# EAGLE schematic diagrama_robot (EAGLE 9.6.2)
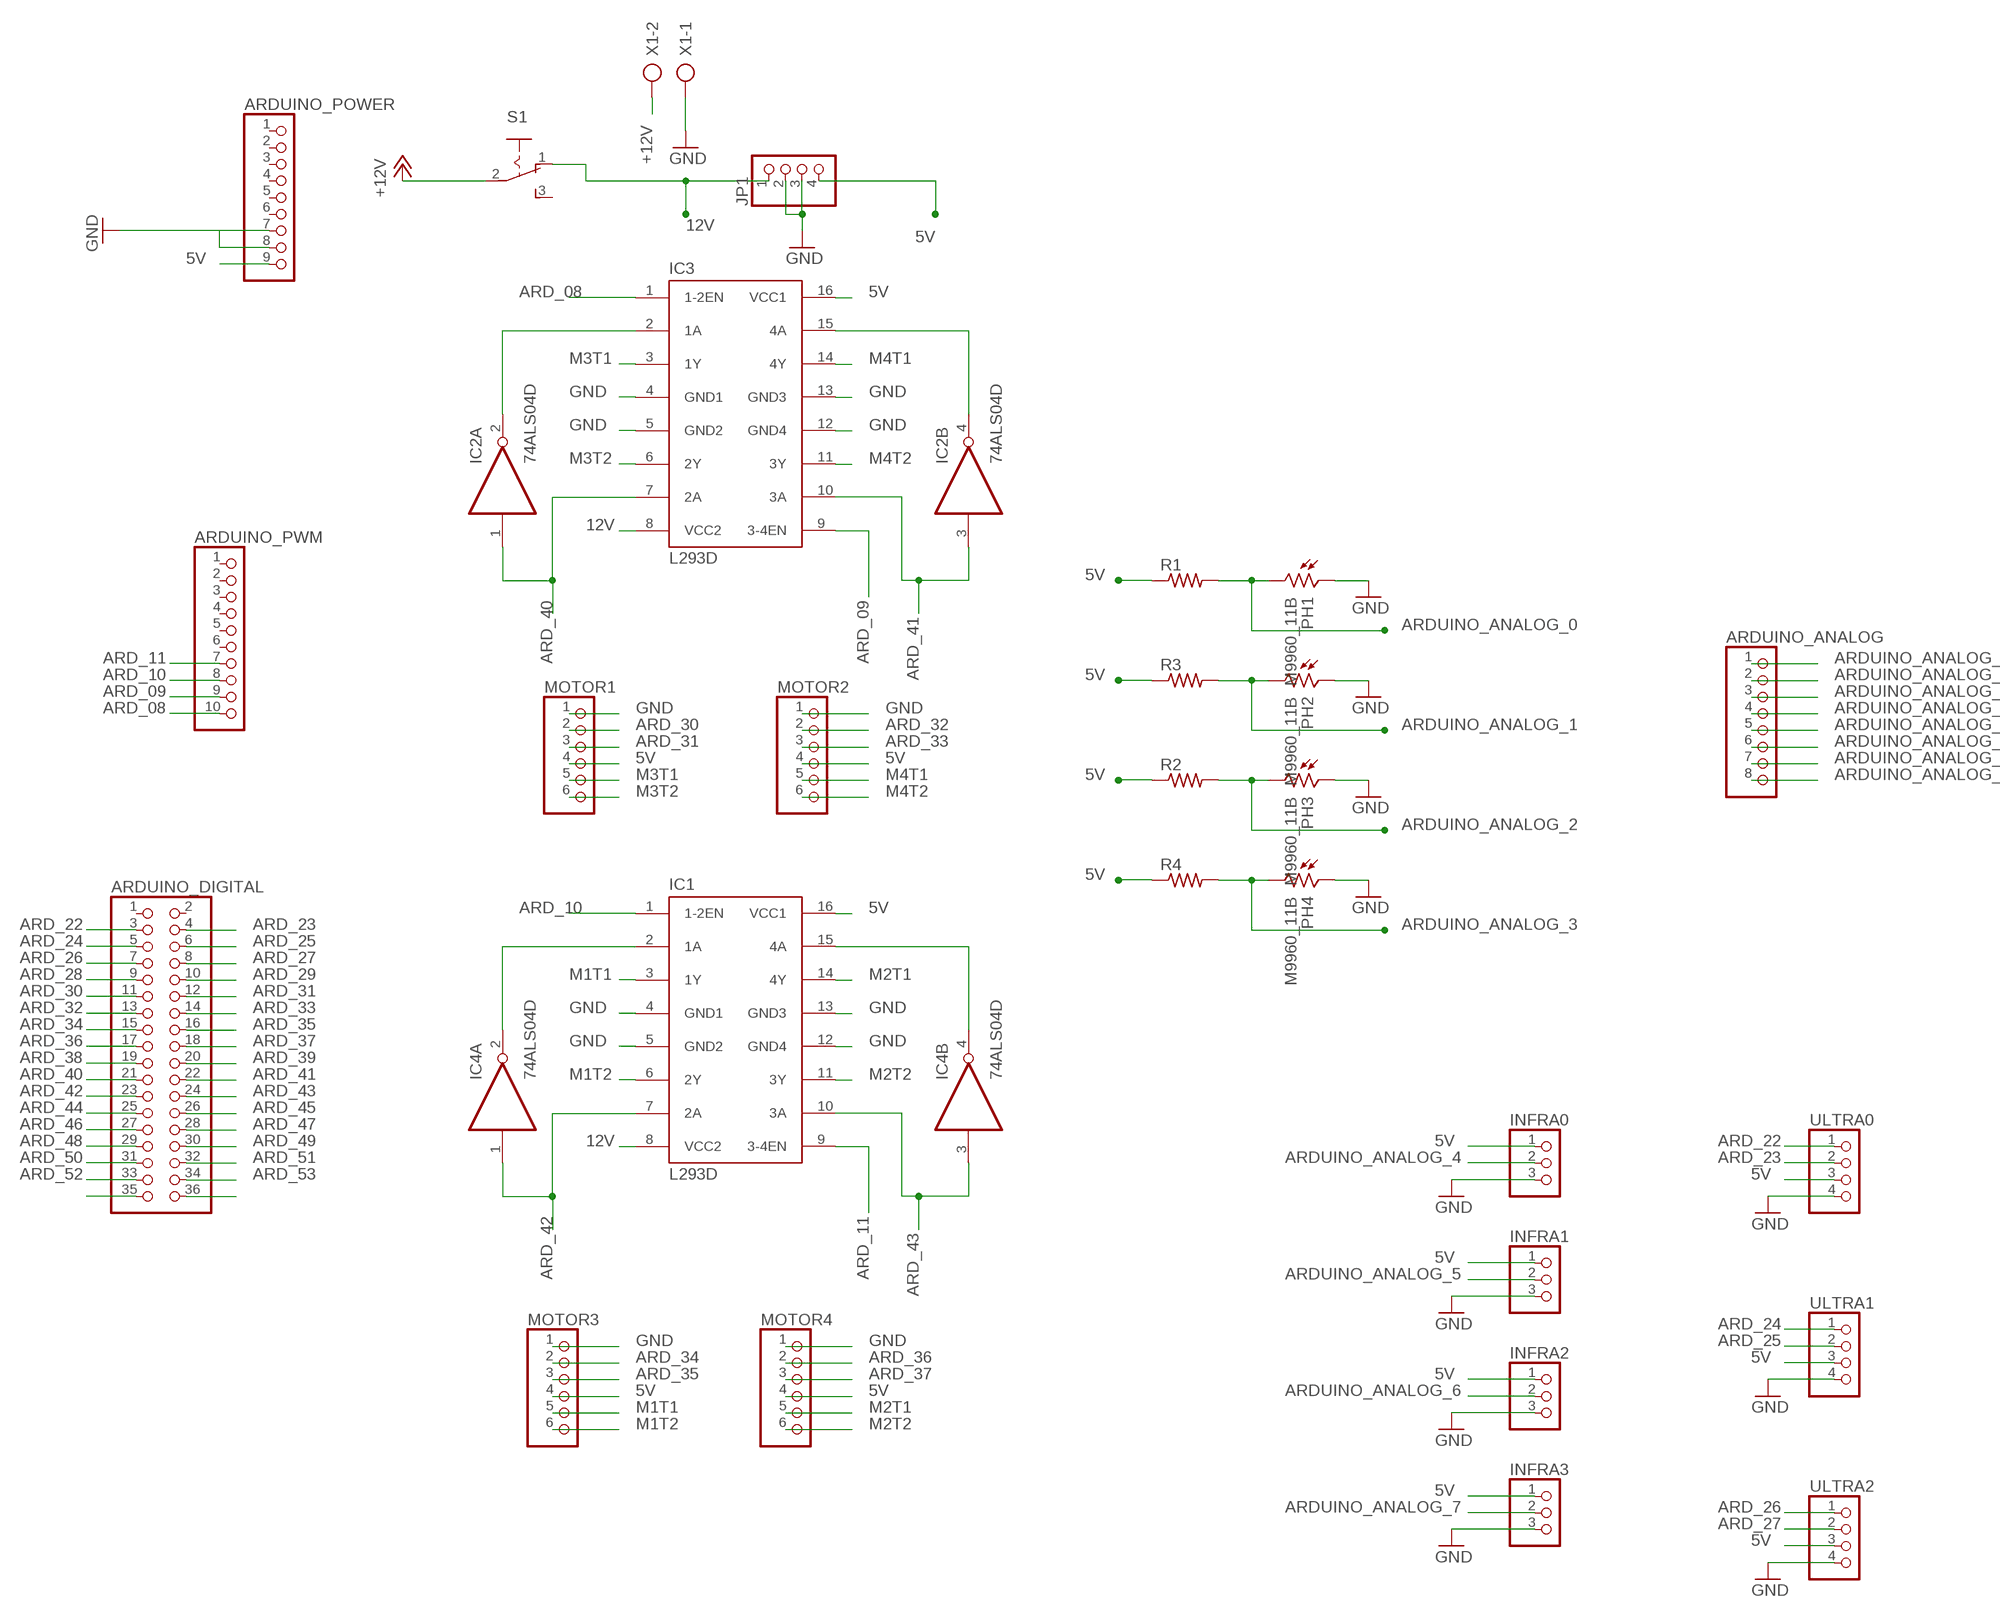
[diagram p0: schematic, sheet 1]

## Parts
ARDUINO_ANALOG  PINHD-1X8  [1X08]
ARDUINO_DIGITAL  PINHD-2X18  [2X18]
ARDUINO_POWER  PINHD-1X9  [1X09]
ARDUINO_PWM  PINHD-1X10  [1X10]
IC1  L293D  [DIL16]
IC2  74ALS04D  [SO14]
IC3  L293D  [DIL16]
IC4  74ALS04D  [SO14]
INFRA0  PINHD-1X3  [1X03]
INFRA1  PINHD-1X3  [1X03]
INFRA2  PINHD-1X3  [1X03]
INFRA3  PINHD-1X3  [1X03]
JP1  PINHD-1X4  [1X04]
MOTOR1  PINHD-1X6  [1X06]
MOTOR2  PINHD-1X6  [1X06]
MOTOR3  PINHD-1X6  [1X06]
MOTOR4  PINHD-1X6  [1X06]
PH1  M9960_11B  [M9960]
PH2  M9960_11B  [M9960]
PH3  M9960_11B  [M9960]
PH4  M9960_11B  [M9960]
R1  R-US_0204/2V  [0204V]
R2  R-US_0204/2V  [0204V]
R3  R-US_0204/2V  [0204V]
R4  R-US_0204/2V  [0204V]
S1  255SB  [255SB]
ULTRA0  PINHD-1X4  [1X04]
ULTRA1  PINHD-1X4  [1X04]
ULTRA2  PINHD-1X4  [1X04]
X1  AK500/2-H  [AK500/2-H]

## Nets
5V: ARDUINO_POWER.9 IC1.16(VCC1) IC3.16(VCC1) INFRA0.1 INFRA1.1 INFRA2.1 INFRA3.1 JP1.4 MOTOR1.4 MOTOR2.4 MOTOR3.4 MOTOR4.4 R1.1 R2.1 R3.1 R4.1 ULTRA0.3 ULTRA1.3 ULTRA2.3
12V: IC1.8(VCC2) IC3.8(VCC2) JP1.1 S1.1(O)
+12V: S1.2(P) X1.2
ARD_08: ARDUINO_PWM.10 IC3.1(1-2EN)
ARD_09: ARDUINO_PWM.9 IC3.9(3-4EN)
ARD_10: ARDUINO_PWM.8 IC1.1(1-2EN)
ARD_11: ARDUINO_PWM.7 IC1.9(3-4EN)
ARD_22: ARDUINO_DIGITAL.3 ULTRA0.1
ARD_23: ARDUINO_DIGITAL.4 ULTRA0.2
ARD_24: ARDUINO_DIGITAL.5 ULTRA1.1
ARD_25: ARDUINO_DIGITAL.6 ULTRA1.2
ARD_26: ARDUINO_DIGITAL.7 ULTRA2.1
ARD_27: ARDUINO_DIGITAL.8 ULTRA2.2
ARD_28: ARDUINO_DIGITAL.9
ARD_29: ARDUINO_DIGITAL.10
ARD_30: ARDUINO_DIGITAL.11 MOTOR1.2
ARD_31: ARDUINO_DIGITAL.12 MOTOR1.3
ARD_32: ARDUINO_DIGITAL.13 MOTOR2.2
ARD_33: ARDUINO_DIGITAL.14 MOTOR2.3
ARD_34: ARDUINO_DIGITAL.15 MOTOR3.2
ARD_35: ARDUINO_DIGITAL.16 MOTOR3.3
ARD_36: ARDUINO_DIGITAL.17 MOTOR4.2
ARD_37: ARDUINO_DIGITAL.18 MOTOR4.3
ARD_38: ARDUINO_DIGITAL.19
ARD_39: ARDUINO_DIGITAL.20
ARD_40: ARDUINO_DIGITAL.21 IC2.1(A:I) IC3.7(2A)
ARD_41: ARDUINO_DIGITAL.22 IC2.3(B:I) IC3.10(3A)
ARD_42: ARDUINO_DIGITAL.23 IC1.7(2A) IC4.1(A:I)
ARD_43: ARDUINO_DIGITAL.24 IC1.10(3A) IC4.3(B:I)
ARD_44: ARDUINO_DIGITAL.25
ARD_45: ARDUINO_DIGITAL.26
ARD_46: ARDUINO_DIGITAL.27
ARD_47: ARDUINO_DIGITAL.28
ARD_48: ARDUINO_DIGITAL.29
ARD_49: ARDUINO_DIGITAL.30
ARD_50: ARDUINO_DIGITAL.31
ARD_51: ARDUINO_DIGITAL.32
ARD_52: ARDUINO_DIGITAL.33
ARD_53: ARDUINO_DIGITAL.34
ARDUINO_ANALOG_0: ARDUINO_ANALOG.1 PH1.2 R1.2
ARDUINO_ANALOG_1: ARDUINO_ANALOG.2 PH2.2 R3.2
ARDUINO_ANALOG_2: ARDUINO_ANALOG.3 PH3.2 R2.2
ARDUINO_ANALOG_3: ARDUINO_ANALOG.4 PH4.2 R4.2
ARDUINO_ANALOG_4: ARDUINO_ANALOG.5 INFRA0.2
ARDUINO_ANALOG_5: ARDUINO_ANALOG.6 INFRA1.2
ARDUINO_ANALOG_6: ARDUINO_ANALOG.7 INFRA2.2
ARDUINO_ANALOG_7: ARDUINO_ANALOG.8 INFRA3.2
GND: ARDUINO_POWER.7 ARDUINO_POWER.8 IC1.4(GND1) IC1.5(GND2) IC1.12(GND4) IC1.13(GND3) IC3.4(GND1) IC3.5(GND2) IC3.12(GND4) IC3.13(GND3) INFRA0.3 INFRA1.3 INFRA2.3 INFRA3.3 JP1.2 JP1.3 MOTOR1.1 MOTOR2.1 MOTOR3.1 MOTOR4.1 PH1.1 PH2.1 PH3.1 PH4.1 ULTRA0.4 ULTRA1.4 ULTRA2.4 X1.1
M1T1: IC1.3(1Y) MOTOR3.5
M1T2: IC1.6(2Y) MOTOR3.6
M2T1: IC1.14(4Y) MOTOR4.5
M2T2: IC1.11(3Y) MOTOR4.6
M3T1: IC3.3(1Y) MOTOR1.5
M3T2: IC3.6(2Y) MOTOR1.6
M4T1: IC3.14(4Y) MOTOR2.5
M4T2: IC3.11(3Y) MOTOR2.6
N$1: IC1.2(1A) IC4.2(A:O)
N$2: IC2.2(A:O) IC3.2(1A)
N$3: IC2.4(B:O) IC3.15(4A)
N$4: ARDUINO_DIGITAL.35
N$5: IC1.15(4A) IC4.4(B:O)
N$7: ARDUINO_DIGITAL.36
Unconnected: ARDUINO_DIGITAL.1 ARDUINO_DIGITAL.2 ARDUINO_POWER.1 ARDUINO_POWER.2 ARDUINO_POWER.3 ARDUINO_POWER.4 ARDUINO_POWER.5 ARDUINO_POWER.6 ARDUINO_PWM.1 ARDUINO_PWM.2 ARDUINO_PWM.3 ARDUINO_PWM.4 ARDUINO_PWM.5 ARDUINO_PWM.6 IC2.5(C:I) IC2.6(C:O) IC2.8(D:O) IC2.9(D:I) IC2.10(E:O) IC2.11(E:I) IC2.12(F:O) IC2.13(F:I) IC4.5(C:I) IC4.6(C:O) IC4.8(D:O) IC4.9(D:I) IC4.10(E:O) IC4.11(E:I) IC4.12(F:O) IC4.13(F:I) S1.3(S)

## Power pins joined to a net without a drawn wire
GND: IC2.7(P:GND) IC4.7(P:GND)
VCC: IC2.14(P:VCC) IC4.14(P:VCC)

## Library data of the parts
ARDUINO_ANALOG = pinhead:PINHD-1X8: PIN HEADER
ARDUINO_DIGITAL = pinhead:PINHD-2X18: PIN HEADER
ARDUINO_POWER = pinhead:PINHD-1X9: PIN HEADER
ARDUINO_PWM = pinhead:PINHD-1X10: PIN HEADER
IC1 IC3 = st-microelectronics:L293D: PUSH-PULL 4 CHANNEL DRIVER; MPN: L293D; OC_FARNELL: 9589619; OC_NEWARK: 56P8249
IC2 IC4 = 74xx-us:74*04: Hex INVERTER
INFRA0 INFRA1-INFRA3 = pinhead:PINHD-1X3: PIN HEADER
JP1 ULTRA0 ULTRA1 ULTRA2 = pinhead:PINHD-1X4: PIN HEADER
MOTOR1-MOTOR4 = pinhead:PINHD-1X6: PIN HEADER
PH1-PH4 = photo-elements:M9960_11: Photo Sensor Beacon Light, Photometer Applications Source: http://optoelectronics.perkinelmer.com/content/Datasheets/DTS_M9960.pdf
R1-R4 = rcl:R-US_: RESISTOR, American symbol; SPICEPREFIX: R
S1 = switch:255SB: SLIDING SWITCH Distributor Buerklin, 11G810
X1 = con-ptr500:AK500/2-H: CONNECTOR Aug. 2004 / PTR Meßtechnik: Die Bezeichnung der Serie AK505 wurde geändert. Es handelt sich hierbei um AK500 in horizontaler Ausführung.; OC_FARNELL: unknown; OC_NEWARK: unknown